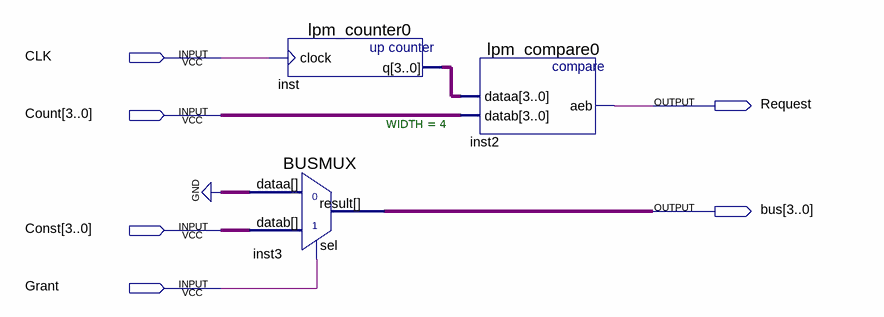
[diagram p0: schematic sheet]
// Quartus schematic UniSlave.bdf as structural Verilog: 3 symbols, 6 pins
module UniSlave (
  input  CLK,
  input  [3:0] Count,
  input  [3:0] Const,
  input  Grant,
  output Request,
  output [3:0] bus
);

  wire [3:0] inst_q;

  lpm_counter0 inst (.clock(CLK), .q(inst_q));
  BUSMUX #(.WIDTH(4)) inst3 (.datab(Const), .sel(Grant), .dataa(4'b0000), .result(bus));
  lpm_compare0 inst2 (.dataa(inst_q), .datab(Count), .aeb(Request));
endmodule
